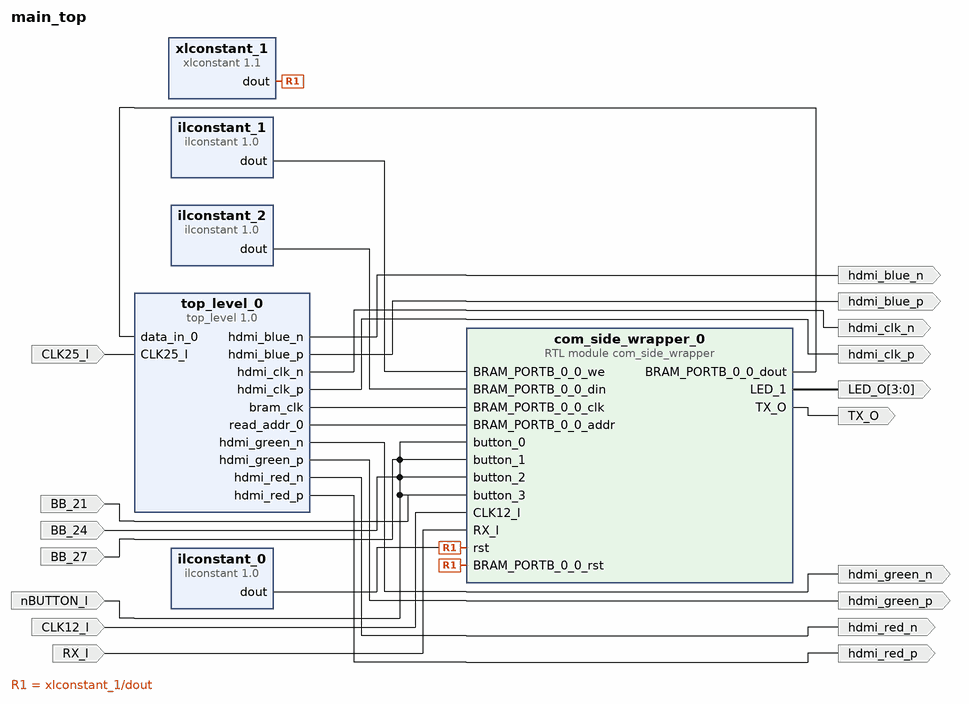
[diagram p0: block diagram of the top level]
# Vivado block design main_top, xc7s15ftgb196-1, Vivado 2025.2
create_bd_design main_top

create_bd_port -dir I RX_I
create_bd_port -dir I BB_21
create_bd_port -dir I nBUTTON_I
create_bd_port -dir I BB_24
create_bd_port -dir I BB_27
create_bd_port -dir I CLK12_I
create_bd_port -dir I CLK25_I
create_bd_port -dir O TX_O
create_bd_port -dir O -type clk hdmi_clk_p
create_bd_port -dir O hdmi_green_n
create_bd_port -dir O hdmi_blue_n
create_bd_port -dir O hdmi_green_p
create_bd_port -dir O hdmi_red_n
create_bd_port -dir O hdmi_blue_p
create_bd_port -dir O -type clk hdmi_clk_n
create_bd_port -dir O hdmi_red_p
create_bd_port -dir O -from 3 -to 0 LED_O

create_bd_cell -type ip -vlnv user.org:user:top_level:1.0 top_level_0
create_bd_cell -type module -reference com_side_wrapper com_side_wrapper_0
create_bd_cell -type ip -vlnv xilinx.com:ip:xlconstant:1.1 xlconstant_1
set_property -dict {CONFIG.CONST_VAL 0} [get_bd_cells xlconstant_1]
create_bd_cell -type inline_hdl -vlnv xilinx.com:inline_hdl:ilconstant:1.0 ilconstant_0
create_bd_cell -type inline_hdl -vlnv xilinx.com:inline_hdl:ilconstant:1.0 ilconstant_1
set_property -dict {CONFIG.CONST_VAL 0 CONFIG.CONST_WIDTH 4} [get_bd_cells ilconstant_1]
create_bd_cell -type inline_hdl -vlnv xilinx.com:inline_hdl:ilconstant:1.0 ilconstant_2
set_property -dict {CONFIG.CONST_VAL 0 CONFIG.CONST_WIDTH 32} [get_bd_cells ilconstant_2]

# ---- connections ----

connect_bd_net -net BB_21_1 [get_bd_ports BB_21] [get_bd_pins com_side_wrapper_0/button_3]
connect_bd_net -net BB_24_1 [get_bd_ports BB_24] [get_bd_pins com_side_wrapper_0/button_2]
connect_bd_net -net BB_27_1 [get_bd_ports BB_27] [get_bd_pins com_side_wrapper_0/button_1]
connect_bd_net -net BB_30_1 [get_bd_ports nBUTTON_I] \
  [get_bd_pins com_side_wrapper_0/button_0] [get_bd_pins com_side_wrapper_0/button_1] \
  [get_bd_pins com_side_wrapper_0/button_2] [get_bd_pins com_side_wrapper_0/button_3]
connect_bd_net [get_bd_ports CLK12_I] [get_bd_pins com_side_wrapper_0/CLK12_I]
connect_bd_net [get_bd_ports CLK25_I] [get_bd_pins top_level_0/CLK25_I]
connect_bd_net [get_bd_ports RX_I] [get_bd_pins com_side_wrapper_0/RX_I]
connect_bd_net [get_bd_pins com_side_wrapper_0/BRAM_PORTB_0_0_dout] [get_bd_pins top_level_0/data_in_0]
connect_bd_net [get_bd_pins com_side_wrapper_0/LED_1] [get_bd_ports LED_O]
connect_bd_net [get_bd_pins com_side_wrapper_0/TX_O] [get_bd_ports TX_O]
connect_bd_net [get_bd_pins ilconstant_0/dout] [get_bd_pins com_side_wrapper_0/rst]
connect_bd_net [get_bd_pins ilconstant_1/dout] [get_bd_pins com_side_wrapper_0/BRAM_PORTB_0_0_we]
connect_bd_net [get_bd_pins ilconstant_2/dout] [get_bd_pins com_side_wrapper_0/BRAM_PORTB_0_0_din]
connect_bd_net [get_bd_pins top_level_0/bram_clk] [get_bd_pins com_side_wrapper_0/BRAM_PORTB_0_0_clk]
connect_bd_net [get_bd_pins top_level_0/hdmi_blue_n] [get_bd_ports hdmi_blue_n]
connect_bd_net [get_bd_pins top_level_0/hdmi_blue_p] [get_bd_ports hdmi_blue_p]
connect_bd_net [get_bd_pins top_level_0/hdmi_clk_n] [get_bd_ports hdmi_clk_n]
connect_bd_net [get_bd_pins top_level_0/hdmi_clk_p] [get_bd_ports hdmi_clk_p]
connect_bd_net [get_bd_pins top_level_0/hdmi_green_n] [get_bd_ports hdmi_green_n]
connect_bd_net [get_bd_pins top_level_0/hdmi_green_p] [get_bd_ports hdmi_green_p]
connect_bd_net [get_bd_pins top_level_0/hdmi_red_n] [get_bd_ports hdmi_red_n]
connect_bd_net [get_bd_pins top_level_0/hdmi_red_p] [get_bd_ports hdmi_red_p]
connect_bd_net [get_bd_pins top_level_0/read_addr_0] [get_bd_pins com_side_wrapper_0/BRAM_PORTB_0_0_addr]
connect_bd_net [get_bd_pins xlconstant_1/dout] [get_bd_pins com_side_wrapper_0/BRAM_PORTB_0_0_rst] [get_bd_pins com_side_wrapper_0/rst]

validate_bd_design
save_bd_design
